# Altium schematic sheet TopLevelSchematic.SchDoc
size A
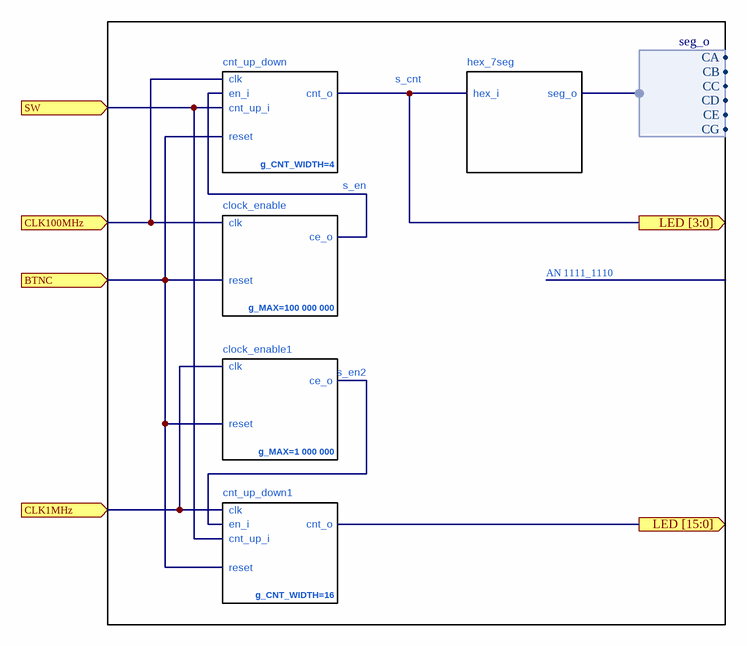
[diagram p0: TopLevelSchematic.SchDoc]

## Ports
BTNC (in), CLK1MHz (in), CLK100MHz (in), LED [3:0] (out), LED [15:0] (out), SW (in)

## Harnesses
seg_o: CA, CB, CC, CD, CE, CG

## Notes on the sheet
- clk
- en_i
- cnt_up_i
- cnt_up_down
- cnt_o
- s_cnt
- hex_i
- hex_7seg
- seg_o
- reset
- g_CNT_WIDTH=4
- clock_enable
- ce_o
- s_en
- g_MAX=100 000 000
- AN 1111_1110
- clock_enable1
- s_en2
- g_MAX=1 000 000
- cnt_up_down1
- g_CNT_WIDTH=16